# EAGLE design USB_Power _V1 (EAGLE 9.3.0)
AUTHOR: K. TOWNSEND
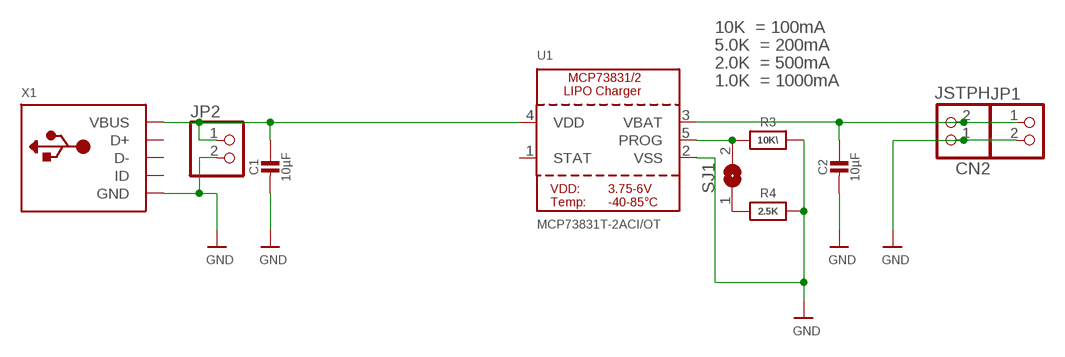
[diagram p0: schematic, sheet 1]

## Parts
C1  10µF  CAP_CERAMIC0805-NOOUTLINE  [0805-NO]
C2  10µF  CAP_CERAMIC0805-NOOUTLINE  [0805-NO]
CN2  JSTPH  JST_2PIN  [JSTPH2]
JP1  HEADER-1X2ROUND  [1X02_ROUND]
JP2  HEADER-1X2ROUND  [1X02_ROUND]
R3  10K\  RESISTOR0805_NOOUTLINE  [0805-NO]
R4  2.5K  RESISTOR0805_NOOUTLINE  [0805-NO]
SJ1  SOLDERJUMPER  [SOLDERJUMPER_ARROW_NOPASTE]
U1  MCP73831T-2ACI/OT  MCP73831/2  [SOT23-5]
X1  USB_MEDIUM  [USB-MINI_MEDIUM]

## Nets
GND: C1.2 C2.2 CN2.1 JP1.2 JP2.2 R3.2 R4.2 U1.2(VSS) X1.GND X1.GND1(GND) X1.GND2(GND) X1.GND3(GND) X1.GND4(GND)
N$3: R4.1 SJ1.1
N$5: R3.1 SJ1.2 U1.5(PROG)
VBAT: C2.1 CN2.2 JP1.1 U1.3(VBAT)
VDD: C1.1 JP2.1 U1.4(VDD) X1.VBUS
Unconnected: U1.1(STAT) X1.D+ X1.D- X1.ID

## Notes on the sheet
- 10K  = 100mA
- 5.0K  = 200mA
- 2.0K  = 500mA
- 1.0K  = 1000mA

## Library data of the parts
C1 C2 = microbuilder:CAP_CERAMIC: Ceramic Capacitors For new designs, use the packages preceded by an '_' character since they are more reliable: The following footprints should be used on most boards: _0402 - Standard footprint for regular board layouts _0603 - Standard footprint for regular board layouts _0805 - Standard footprint for regular board layouts _1206 - Standard footprint for regular board layouts For extremely tight-pitch boards where space is at a premium, the following 'micro-pitch' footprints can be used (smaller pads, no silkscreen outline, etc.): _0402MP - Micro-pitch footprint for very dense/compact boards _0603MP - Micro-pitch footprint for very dense/compact boards _0805MP - Micro-pitch footprint for very dense/compact boards _1206MP - Micro-pitch footprint for very dense/compact boards
CN2 = microbuilder:JST_2PIN: JST 2-Pin Right-Angle Connector PH-Series - 4UConnector: 17311 SH-Series - 4UConnector: 07278
JP1 JP2 = microbuilder:HEADER-1X2: PIN HEADER
R3 R4 = microbuilder:RESISTOR: Resistors For new designs, use the packages preceded by an '_' character since they are more reliable: The following footprints should be used on most boards: _0402 - Standard footprint for regular board layouts _0603 - Standard footprint for regular board layouts _0805 - Standard footprint for regular board layouts _1206 - Standard footprint for regular board layouts For extremely tight-pitch boards where space is at a premium, the following 'micro-pitch' footprints can be used (smaller pads, no silkscreen outline, etc.): _0402MP - Micro-pitch footprint for very dense/compact boards _0603MP - Micro-pitch footprint for very dense/compact boards _0805MP - Micro-pitch footprint for very dense/compact boards _1206MP - Micro-pitch footprint for very dense/compact boards
SJ1 = microbuilder:SOLDERJUMPER: SMD Solder JUMPER Solder the two pads together to create a connection, or remove the solder to break it. REFLOW - Use this footprint for solder paste and reflow ovens. WAVE - Use this footprint for hand-soldering (larger pads). CLOSED - Has a trace between the two pads to ensure it is closed by default. The trace needs to be cut to disable the jumper, and can be closed again by creating a solder bridge between the two pads.; BOM: EXCLUDE
U1 = microbuilder:MCP73831/2: MCP73831/2 LIPO Charger VDD: 3.75 - 6V Temp -40 - 85°C Programmable Charge Rate: 15-500mA NOTE: STAT is a tri-state logic output on the MCP73831 and an open-drain output on the MCP73832. SOT23-5 with 4.2V output and tri-state logic on STAT = MCP73831T-2ACI/OT
X1 = microbuilder:USB: USB Connectors USBMINIB - Surface Mount Female Mini-B USB Connector 4UConnector: 06564

## Board
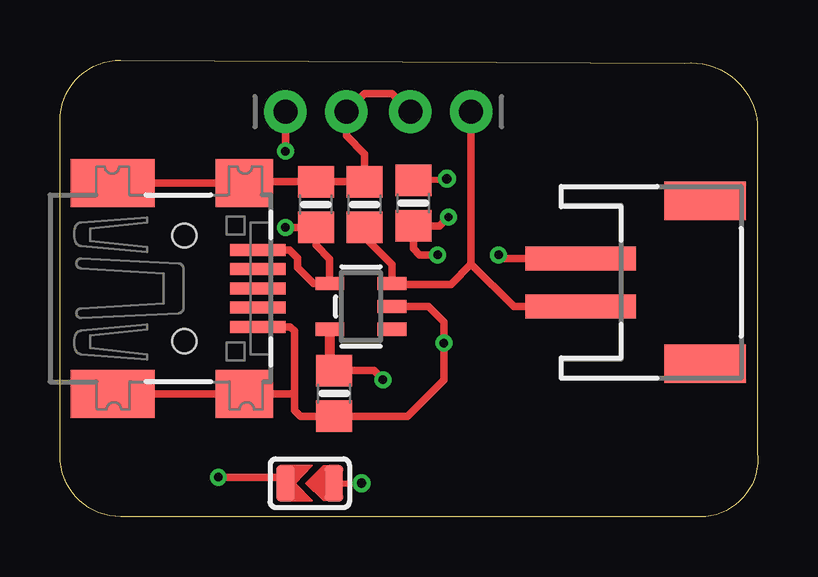
[diagram p1: board, top side]
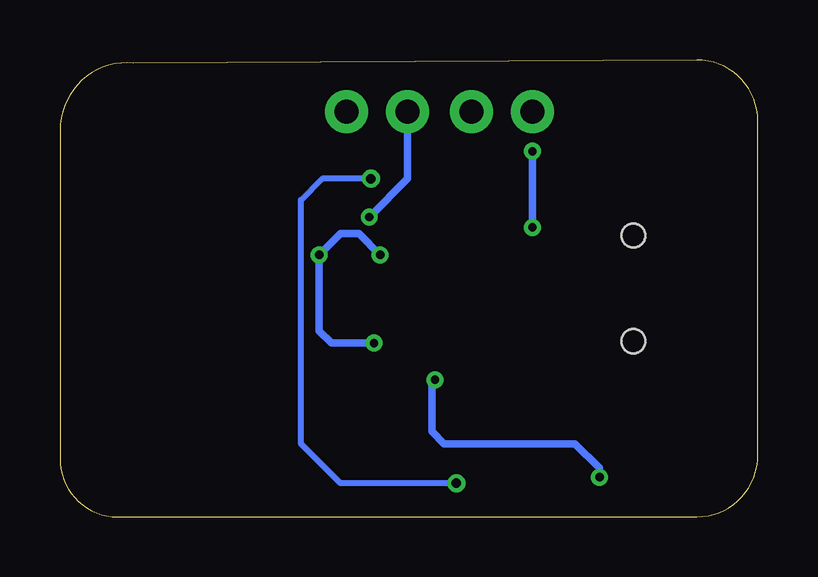
[diagram p2: board, bottom side, seen from below]

Size 29.1 x 19.05 mm. Coordinates in mm from the lower left corner, seen from the top.
Outline: 2.54,19.05 26.04,18.92 arc-90 29.08,16.38 29.08,2.67 arc-90 26.92,0 2.54,0 arc-90 0,2.54 0,16.51 arc-90 2.54,19.05
Copper layers (1*16): Top 0.0356mm / dielectric 1.5011mm / Bottom 0.0356mm
Design rules "ECE_Senior_Design *": minimum track width 8mil, minimum drill 13mil, track to track 8mil, track to pad 8mil, pad to pad 6mil, via to via 8mil, smd to smd 6mil, copper to edge 15mil, drill to drill 8mil, minimum pad ring 7mil, minimum via ring 7mil, stop-mask expansion 3mil, vias tented up to drill 0mil, thermal gap 10mil

### Footprints (pad centres in the part's own frame; a part is rotated, then mirrored left to right if it is on the bottom)
0805-NO = smd 1.3 x 1.5: 1 -0.95,0; 2 0.95,0
JSTPH2 = smd 1 x 4.6: 1 -1,-3.7; 2 1,-3.7 | smd 1.6 x 3.4: NC1 -3.4,1.5; NC2 3.4,1.5
1X02_ROUND = drill 1 pad 1.778: 1 -1.27,0; 2 1.27,0
SOLDERJUMPER_ARROW_NOPASTE = smd 0.762 x 1.524: 1 -1.016,0; 2 1.016,0
SOT23-5 = smd 0.55 x 1.2: 1 -0.95,-1.3; 2 0,-1.3; 3 0.95,-1.3; 4 0.95,1.3; 5 -0.95,1.3
USB-MINI_MEDIUM = smd 0.5 x 2.308: D+ 0,4.064; D- -0.8,4.064; GND 1.6,4.064; ID 0.8,4.064; VBUS -1.6,4.064 | smd 2 x 3.5: GND1 -4.4,-2; GND4 4.4,-2 | smd 2 x 2.4: GND2 -4.4,3.5; GND3 4.4,3.5 | hole 1: -2.2,1; 2.2,1

### Placement (x,y rotation side)
C1  10.67,13.02 90 top
C2  12.7,13.02 90 top
CN2  25.4,9.78 270 top
JP1  15.88,16.89 180 top
JP2  10.67,16.89 0 top
R3  11.43,5.14 270 top
R4  14.73,13.08 270 top
SJ1  10.41,1.4 180 top
U1  12.55,8.77 90 top
X1  4.19,9.53 270 top

### Tracks (layer width: path | path; a pad name or v marks a point on that pad's centre or on a via)
GND  (via drill 0.35)
  Top 0.305: X1.GND4 X1.GND3 9.73,5.12 9.78,5.08 | U1.2 15.36,8.77 16,8.13 v16,7.24 16,5.71 14.48,4.19 R3.2 10.03,4.19 9.78,4.45 9.78,5.08 | v18.29,10.92 18.41,10.92 18.56,10.78 CN2.1 | v15.75,10.92 14.99,10.92 14.73,11.18 R4.2 15.83,12.13 v16.2,12.5 | JP1.2 13.84,17.65 12.7,17.65 JP2.2 11.94,15.89 12.7,15.13 C2.2 C1.2 7.73,13.97 X1.GND2 X1.GND1 | X1.GND 9.6,7.92 9.78,7.75 9.78,5.08
  Bottom 0.305: v16,7.24 17.78,7.24 18.29,7.75 v18.29,10.92 17.4,11.81 16.64,11.81 v15.75,10.92 | v16.2,12.5 14.61,14.1 JP1.2
N$3  (via drill 0.39)
  Top 0.254: SJ1.1 v12.57,1.4 | v16.13,14.1 16.06,14.03 R4.1
  Bottom 0.254: v12.57,1.4 17.4,1.4 19.05,3.05 19.05,13.21 18.16,14.1 v16.13,14.1
N$5  (via drill 0.35)
  Top 0.305: R3.1 13.08,6.09 v13.46,5.71 | v6.6,1.65 9.14,1.65 SJ1.2
  Top 0.406: U1.5 11.25,6.28 R3.1
  Bottom 0.305: v13.46,5.71 13.59,5.59 13.59,3.56 13.08,3.05 7.62,3.05 6.6,2.03 v6.6,1.65
VBAT
  Top 0.305: 17.14,10.54 JP1.1 | 17.14,10.54 16.3,9.69 13.87,9.69 U1.3 13.85,10.52 12.7,11.67 C2.1 | 17.14,10.54 18.92,8.76 21.68,8.76 CN2.2
VDD  (via drill 0.35)
  Top 0.305: v9.4,12.06 v9.4,12.07 C1.1 10.67,11.33 11.25,10.75 U1.4 10.58,9.72 9.9,10.4 9.9,10.8 9.57,11.12 X1.VBUS | v9.4,15.24 JP2.1
  Bottom 0.305: v9.4,12.06 v9.4,15.24